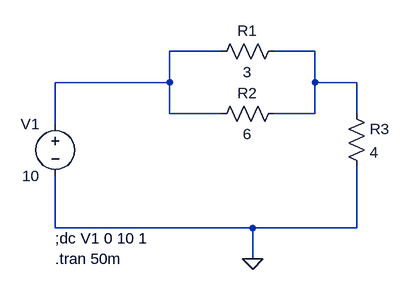
[diagram p0: schematic hw1.asc]
hw1.asc, the LTspice schematic file:
Version 4
SHEET 1 880 680
WIRE 288 32 208 32
WIRE 432 32 368 32
WIRE 208 80 208 32
WIRE 208 80 32 80
WIRE 432 80 432 32
WIRE 496 80 432 80
WIRE 208 128 208 80
WIRE 288 128 208 128
WIRE 432 128 432 80
WIRE 432 128 368 128
WIRE 496 128 496 80
WIRE 32 144 32 80
WIRE 32 304 32 224
WIRE 336 304 32 304
WIRE 496 304 496 208
WIRE 496 304 336 304
WIRE 336 352 336 304
FLAG 336 352 0
SYMBOL voltage 32 128 M0
WINDOW 123 0 0 Left 2
WINDOW 39 0 0 Left 2
SYMATTR InstName V1
SYMATTR Value 10
SYMBOL res 272 48 R270
WINDOW 0 32 56 VTop 2
WINDOW 3 0 56 VBottom 2
SYMATTR InstName R1
SYMATTR Value 3
SYMBOL res 272 144 R270
WINDOW 0 32 56 VTop 2
WINDOW 3 0 56 VBottom 2
SYMATTR InstName R2
SYMATTR Value 6
SYMBOL res 480 112 R0
SYMATTR InstName R3
SYMATTR Value 4
TEXT 32 320 Left 2 !;dc V1 0 10 1
TEXT 32 352 Left 2 !.tran 50m

The netlist it stands for:
* hw1.asc
V1 N001 0 10
R1 N001 N002 3
R2 N001 N002 6
R3 N002 0 4
;dc V1 0 10 1
.tran 50m
.backanno
.end